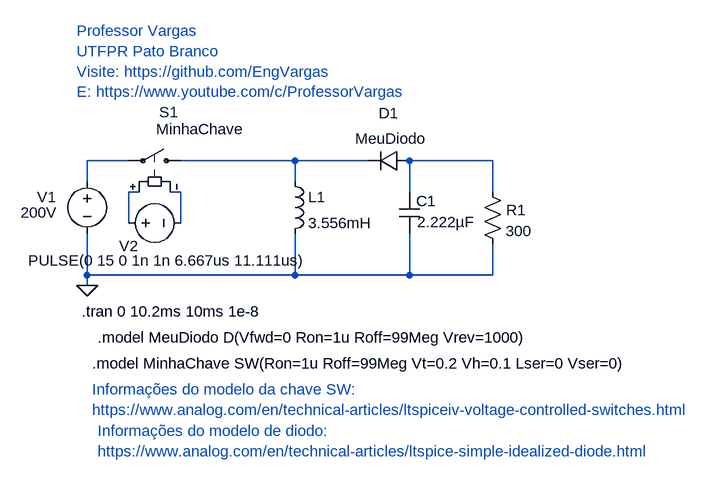
[diagram p0: schematic Conv-A05-Buck-boost_CCM_(LTspice_ideal).asc]
Conv-A05-Buck-boost_CCM_(LTspice_ideal).asc, the LTspice schematic file:
Version 4
SHEET 1 1432 680
WIRE 160 -64 96 -64
WIRE 416 -64 240 -64
WIRE 528 -64 416 -64
WIRE 720 -64 592 -64
WIRE 96 -32 96 -64
WIRE 416 -32 416 -64
WIRE 176 -16 160 -16
WIRE 240 -16 224 -16
WIRE 592 -16 592 -64
WIRE 720 -16 720 -64
WIRE 160 32 160 -16
WIRE 240 32 240 -16
WIRE 96 112 96 48
WIRE 416 112 416 48
WIRE 416 112 96 112
WIRE 592 112 592 48
WIRE 592 112 416 112
WIRE 720 112 720 64
WIRE 720 112 592 112
WIRE 96 128 96 112
FLAG 96 128 0
SYMBOL voltage 96 -48 R0
WINDOW 3 -102 64 Left 2
WINDOW 0 -77 40 Left 2
SYMATTR Value 200V
SYMATTR InstName V1
SYMBOL voltage 144 32 R270
WINDOW 0 -20 16 VBottom 2
WINDOW 3 -73 76 VTop 2
WINDOW 123 0 0 Left 2
WINDOW 39 0 0 Left 2
SYMATTR InstName V2
SYMATTR Value PULSE(0 15 0 1n 1n 6.667us 11.111us)
SYMBOL ind 400 -48 R0
SYMATTR InstName L1
SYMATTR Value 3.556mH
SYMBOL cap 576 -16 R0
WINDOW 0 57 14 Right 2
WINDOW 3 28 46 Left 2
SYMATTR InstName C1
SYMATTR Value 2.222µF
SYMBOL res 704 -32 R0
WINDOW 0 37 44 Left 2
SYMATTR InstName R1
SYMATTR Value 300
SYMBOL diode 592 -80 R90
WINDOW 0 -42 32 VBottom 2
WINDOW 3 -34 28 VTop 2
SYMATTR InstName D1
SYMATTR Value MeuDiodo
SYMBOL sw 256 -64 M270
WINDOW 0 75 49 VLeft 2
WINDOW 3 49 54 VLeft 2
SYMATTR InstName S1
SYMATTR Value MinhaChave
TEXT 88 168 Left 2 !.tran 0 10.2ms 10ms 1e-8
TEXT 112 208 Left 2 !.model MeuDiodo D(Vfwd=0 Ron=1u Roff=99Meg Vrev=1000)
TEXT 104 248 Left 2 !.model MinhaChave SW(Ron=1u Roff=99Meg Vt=0.2 Vh=0.1 Lser=0 Vser=0)
TEXT 104 288 Left 2 ;Informações do modelo da chave SW:\nhttps://www.analog.com/en/technical-articles/ltspiceiv-voltage-controlled-switches.html
TEXT 112 352 Left 2 ;Informações do modelo de diodo:\nhttps://www.analog.com/en/technical-articles/ltspice-simple-idealized-diode.html
TEXT 80 -264 Left 2 ;Professor Vargas\nUTFPR Pato Branco\nVisite: https://github.com/EngVargas\nE: https://www.youtube.com/c/ProfessorVargas

The netlist it stands for:
* Conv-A05-Buck-boost_CCM_(LTspice_ideal).asc
V1 N001 0 200V
V2 N004 N005 PULSE(0 15 0 1n 1n 6.667us 11.111us)
L1 N002 0 3.556mH
C1 N003 0 2.222µF
R1 N003 0 300
D1 N003 N002 MeuDiodo
S1 N002 N001 N004 N005 MinhaChave
.model D D
.lib standard.dio
.tran 0 10.2ms 10ms 1e-8
.model MeuDiodo D(Vfwd=0 Ron=1u Roff=99Meg Vrev=1000)
.model MinhaChave SW(Ron=1u Roff=99Meg Vt=0.2 Vh=0.1 Lser=0 Vser=0)
* Informações do modelo da chave SW:
* https://www.analog.com/en/technical-articles/ltspiceiv-voltage-controlled-switches.html
* Informações do modelo de diodo:
* https://www.analog.com/en/technical-articles/ltspice-simple-idealized-diode.html
* Professor Vargas
* UTFPR Pato Branco
* Visite: https://github.com/EngVargas
* E: https://www.youtube.com/c/ProfessorVargas
.backanno
.end